# Altium project power amp.PrjPCB
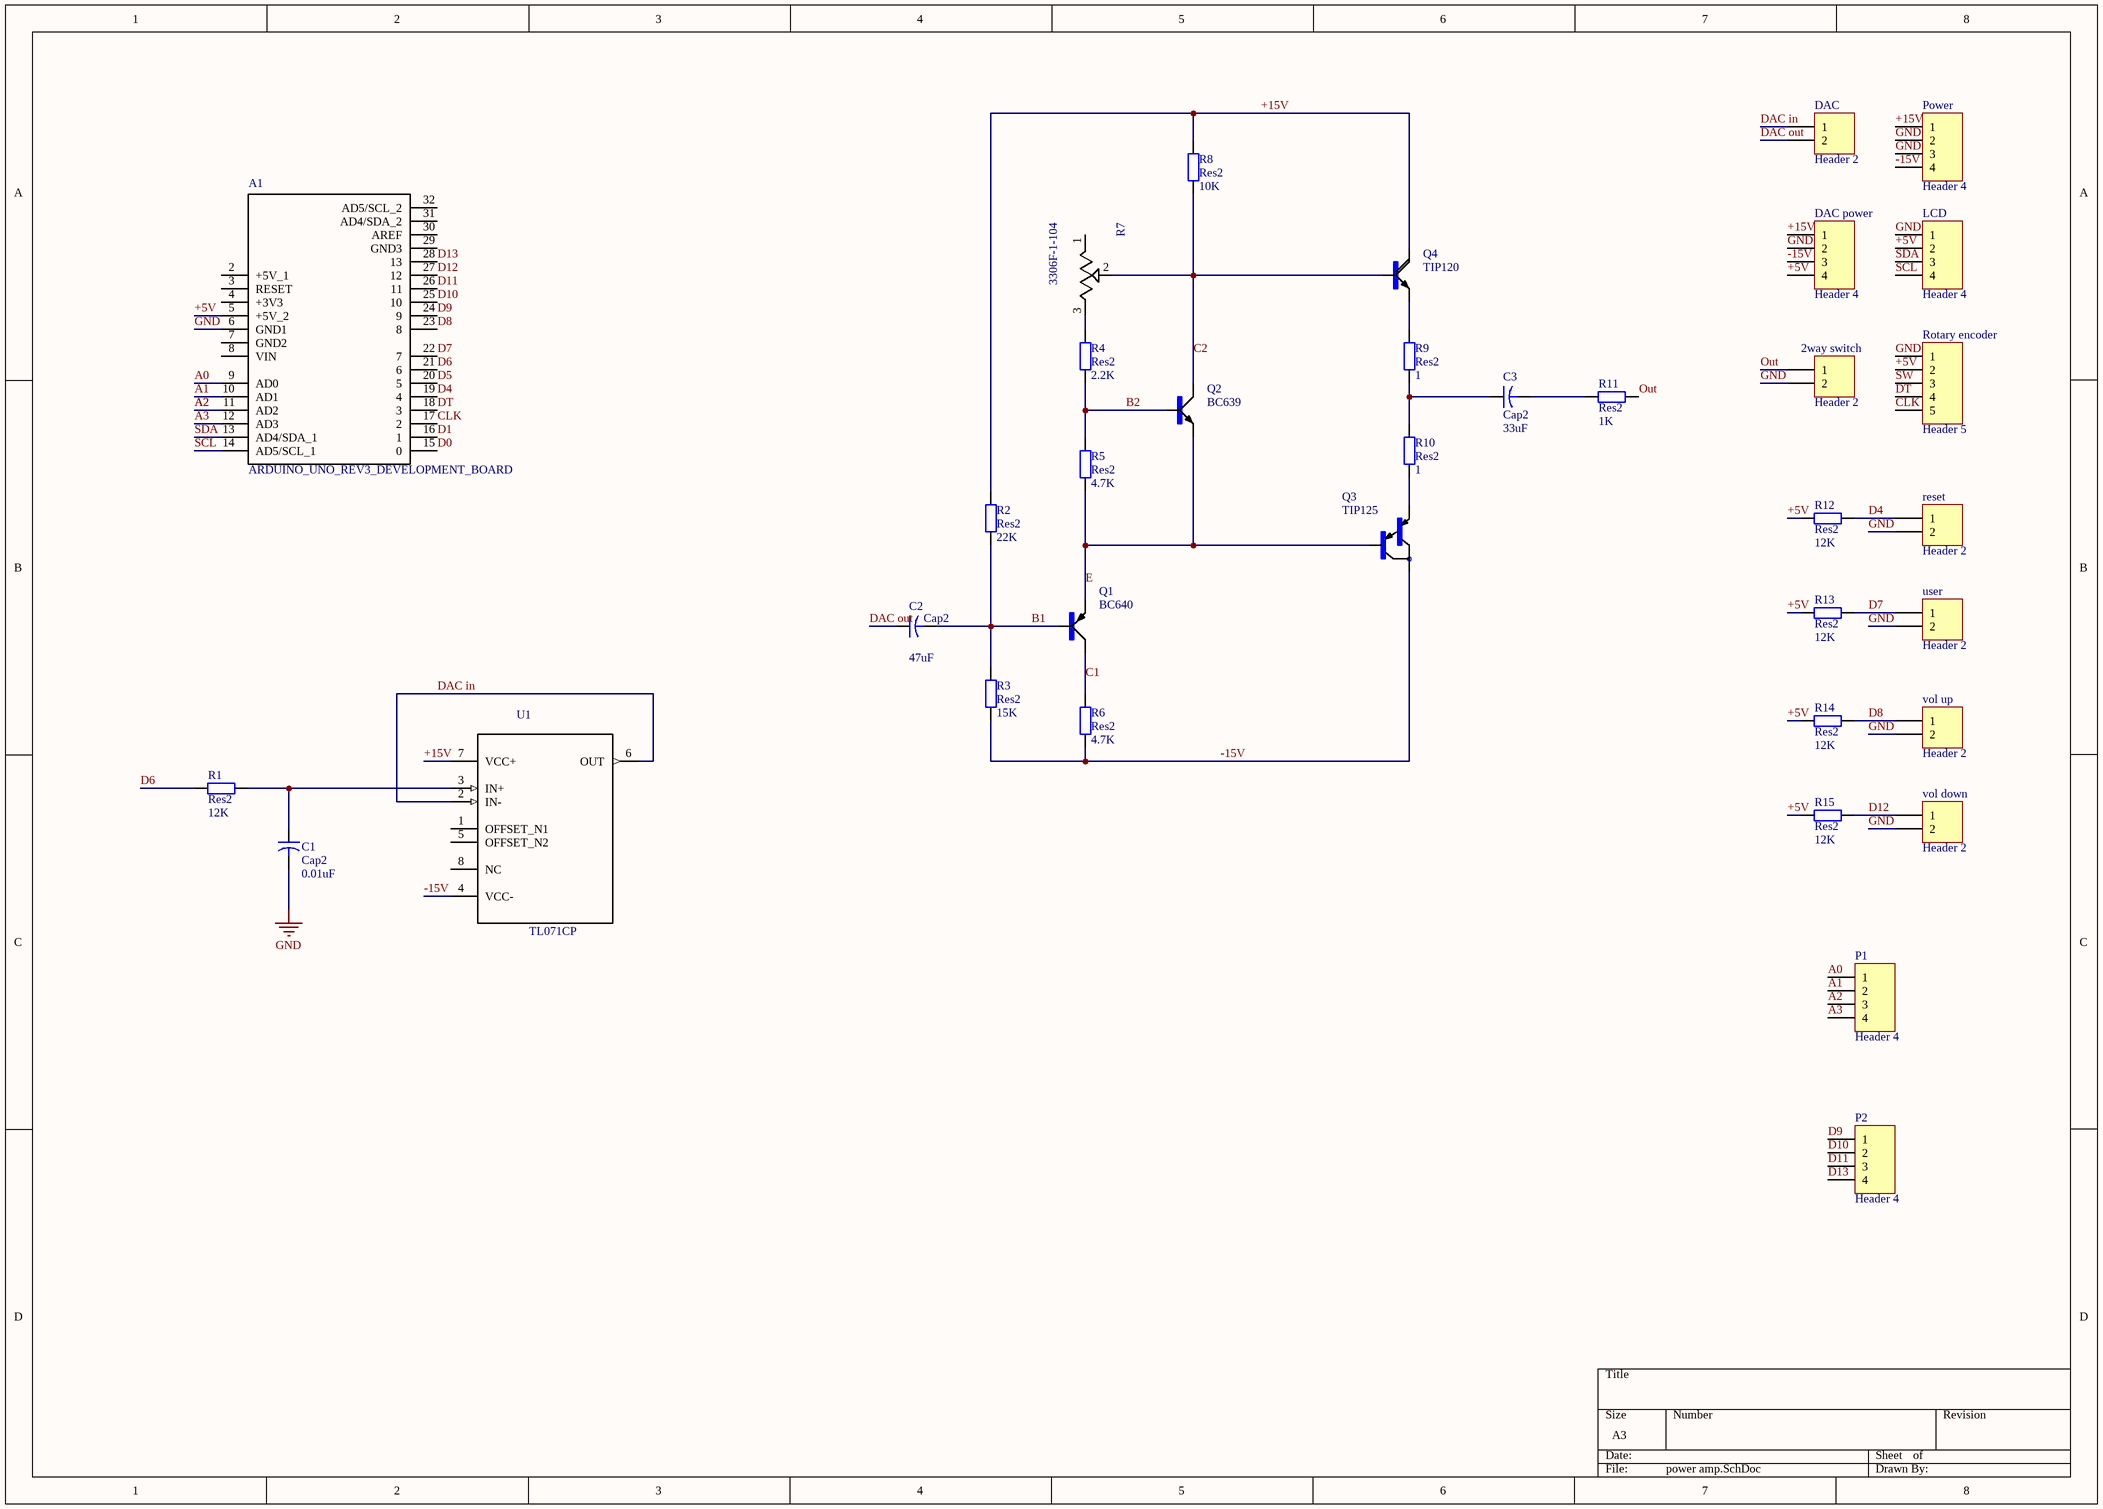
[diagram p0: power amp.SchDoc]
1 sheet, 36 parts. Net scope: global (net labels, ports and power ports of the same name join across sheets).
Board file: power amp.PcbDoc

## Sheet power amp.SchDoc
size A3

### Parts
2way_switch  Header 2  [HDR1X2]
A1  ARDUINO_UNO_REV3_DEVELOPMENT_BOARD  [*ARDUINO_UNO_REV3_DEVELOPMENT_BOARD]
C1  Cap2  value 0.01uF  [CAPR5-4X5]
C2  Cap2  value 47uF  [CAPR5-4X5]
C3  Cap2  value 33uF  [CAPR5-4X5]
DAC  Header 2  [HDR1X2]
DAC_power  Header 4  [HDR1X4]
LCD  Header 4  [HDR1X4]
P1  Header 4  [HDR1X4]
P2  Header 4  [HDR1X4]
Power  Header 4  [HDR1X4]
Q1  BC640  [*SOT54D_BC640(Primary)]
Q2  BC639  [*SOT54D_BC639(Primary)]
Q3  TIP125  [*TO220]
Q4  TIP120  [*TO220AH_TIP120(Primary)]
R1  Res2  value 12K  [AXIAL-0.4]
R2  Res2  value 22K  [AXIAL-0.4]
R3  Res2  value 15K  [AXIAL-0.4]
R4  Res2  value 2.2K  [AXIAL-0.4]
R5  Res2  value 4.7K  [AXIAL-0.4]
R6  Res2  value 4.7K  [AXIAL-0.4]
R7  3306F-1-104  [*TRIM_3306F-1-104]
R8  Res2  value 10K  [AXIAL-0.4]
R9  Res2  value 1  [AXIAL-0.4]
R10  Res2  value 1  [AXIAL-0.4]
R11  Res2  value 1K  [AXIAL-0.4]
R12  Res2  value 12K  [AXIAL-0.4]
R13  Res2  value 12K  [AXIAL-0.4]
R14  Res2  value 12K  [AXIAL-0.4]
R15  Res2  value 12K  [AXIAL-0.4]
reset  Header 2  [HDR1X2]
Rotary_encoder  Header 5  [HDR1X5]
U1  TL071CP  [*DIP254P762X508-8]
user  Header 2  [HDR1X2]
vol_down  Header 2  [HDR1X2]
vol_up  Header 2  [HDR1X2]

### Nets
GND: 2way_switch.2 A1.6(GND1) C1.2 DAC_power.2 LCD.1 Power.2 Power.3 reset.2 Rotary_encoder.1 user.2 vol_down.2 vol_up.2
+5V: A1.5(+5V_2) DAC_power.4 LCD.2 R12.1 R13.1 R14.1 R15.1 Rotary_encoder.2
+15V: DAC_power.1 Power.1 Q4.C R2.2 R8.2 U1.7(VCC+)
-15V: DAC_power.3 Power.4 Q3.2(C) R3.1 R6.1 U1.4(VCC-)
A0: A1.9(AD0) P1.1
A1: A1.10(AD1) P1.2
A2: A1.11(AD2) P1.3
A3: A1.12(AD3) P1.4
B1: C2.2 Q1.B R2.1 R3.2
B2: Q2.B R4.1 R5.2
C1: Q1.C R6.2
C2: Q2.C Q4.B R7.2(W) R8.1
CLK: A1.17(2) Rotary_encoder.5
D0: A1.15(0)
D1: A1.16(1)
D4: A1.19(4) R12.2 reset.1
D5: A1.20(5)
D6: A1.21(6) R1.1
D7: A1.22(7) R13.2 user.1
D8: A1.23(8) R14.2 vol_up.1
D9: A1.24(9) P2.1
D10: A1.25(10) P2.2
D11: A1.26(11) P2.3
D12: A1.27(12) R15.2 vol_down.1
D13: A1.28(13) P2.4
DAC in: DAC.1 U1.2(IN-) U1.6(OUT)
DAC out: C2.1 DAC.2
DT: A1.18(3) Rotary_encoder.4
E: Q1.E Q2.E Q3.1(B) R5.1
Out: 2way_switch.1 R11.1
SCL: A1.14(AD5/SCL_1) LCD.4
SDA: A1.13(AD4/SDA_1) LCD.3
SW: Rotary_encoder.3
NetC1_1: C1.1 R1.2 U1.3(IN+)
NetC3_1: C3.1 R9.1 R10.2
NetC3_2: C3.2 R11.2
NetQ3_3: Q3.3(E) R10.1
NetQ4_E: Q4.E R9.2
NetR4_2: R4.2 R7.3(CW)

Not connected (* = marked no-connect by the designer): A1 2(+5V_1) 3(RESET) 4(+3V3) 7(GND2) 8(VIN) 29(GND3) 30(AREF) 31(AD4/SDA_2) 32(AD5/SCL_2); R7 1(CCW); U1 1(OFFSET_N1) 5(OFFSET_N2) 8(NC)

### Library data of the parts
2way_switch DAC reset user vol_down vol_up = Header 2: Header, 2-Pin; LatestRevisionDate: 17-Jul-2002; LatestRevisionNote: Re-released for DXP Platform.; Publisher: Altium Limited
A1 = ARDUINO_UNO_REV3_DEVELOPMENT_BOARD: Plated Through Hole Protoboard Arduino Mega Platform Evaluation Expansion Board; MP: ARDUINO UNO REV3 DEVELOPMENT BOARD; Availability: Unavailable; SnapEDA_Link: https://www.snapeda.com/parts/ARDUINO%20UNO%20REV3%20DEVELOPMENT%20BOARD/Arduino/view-part/424299/?ref=snap; Price: None; Package: None; MF: Arduino; Value: *
C1-C3 = Cap2: Capacitor; Published: 23-Sep-2002; PackageReference: CAPR5-4X5; Publisher: Altium Limited; PackageDescription: Capacitor; 2 Leads
DAC_power LCD P1 P2 Power = Header 4: Header, 4-Pin; LatestRevisionDate: 17-Jul-2002; LatestRevisionNote: Re-released for DXP Platform.; Publisher: Altium Limited
Q1 = BC640: Bipolar _BJT_ Transistor PNP 80V 500mA 150MHz 625mW Through Hole TO-92-3; MF: ON Semiconductor; Package: TO-92 Continental Device; Price: None; MP: BC640; Availability: Unavailable; SnapEDA_Link: https://www.snapeda.com/parts/BC640/ON%20Semiconductor/view-part/2782146/?ref=snap; Value: *
Q2 = BC639: Bipolar _BJT_ Transistor NPN 80V 1A 200MHz 625mW Through Hole TO-92-3; MF: ON Semiconductor; SnapEDA_Link: https://www.snapeda.com/parts/BC639/ON%20Semiconductor/view-part/761111/?ref=snap; Price: None; Availability: Unavailable; Package: TO-92 Continental Device; MP: BC639; Value: *
Q3 = TIP125: Bipolar _BJT_ Transistor PNP - Darlington 60V 5A 2W Through Hole TO-220-3; MF: ON Semiconductor; Availability: Unavailable; SnapEDA_Link: https://www.snapeda.com/parts/TIP125/ON%20Semiconductor/view-part/110798/?ref=snap; Price: None; MP: TIP125; Package: TO-220 Fairchild Semiconductor; Value: *
Q4 = TIP120: Bipolar _BJT_ Transistor NPN - Darlington 60V 5A 2W Through Hole TO-220-3; MF: ON Semiconductor; SnapEDA_Link: https://www.snapeda.com/parts/TIP120/ON%20Semiconductor/view-part/2842527/?ref=snap; Price: None; Availability: Unavailable; Package: TO-220-3 Bourns; MP: TIP120; Value: *
R1-R6 R8-R15 = Res2: Resistor; Published: 8-Jun-2000; LatestRevisionDate: 17-Jul-2002; LatestRevisionNote: Re-released for DXP Platform.; PackageReference: AXIAL-0.4; Publisher: Altium Limited; PackageDescription: Axial Device, Thru-Hole; 2 Leads; 0.4 in Pin Spacing
R7 = 3306F-1-104: 100 kOhms 0.2W, 1/5W PC Pins Through Hole Trimmer Potentiometer Cermet 1 Turn Top Adjustment; MF: Bourns; Availability: Unavailable; SnapEDA_Link: https://www.snapeda.com/parts/3306F-1-104/Bourns/view-part/372285/?ref=snap; Price: None; MP: 3306F-1-104; Package: 6432 Bourns; Value: *
Rotary_encoder = Header 5: Header, 5-Pin; LatestRevisionDate: 17-Jul-2002; LatestRevisionNote: Re-released for DXP Platform.; Publisher: Altium Limited
U1 = TL071CP: J-FET Amplifier 1 Circuit 8-PDIP; MF: Texas Instruments; Availability: Unavailable; SnapEDA_Link: https://www.snapeda.com/parts/TL071CP/Texas%20Instruments/view-part/52481/?ref=snap; Price: None; MP: TL071CP; Package: DIP-8 Texas Instruments; Value: *